# EAGLE schematic Cautin (EAGLE 9.6.2)
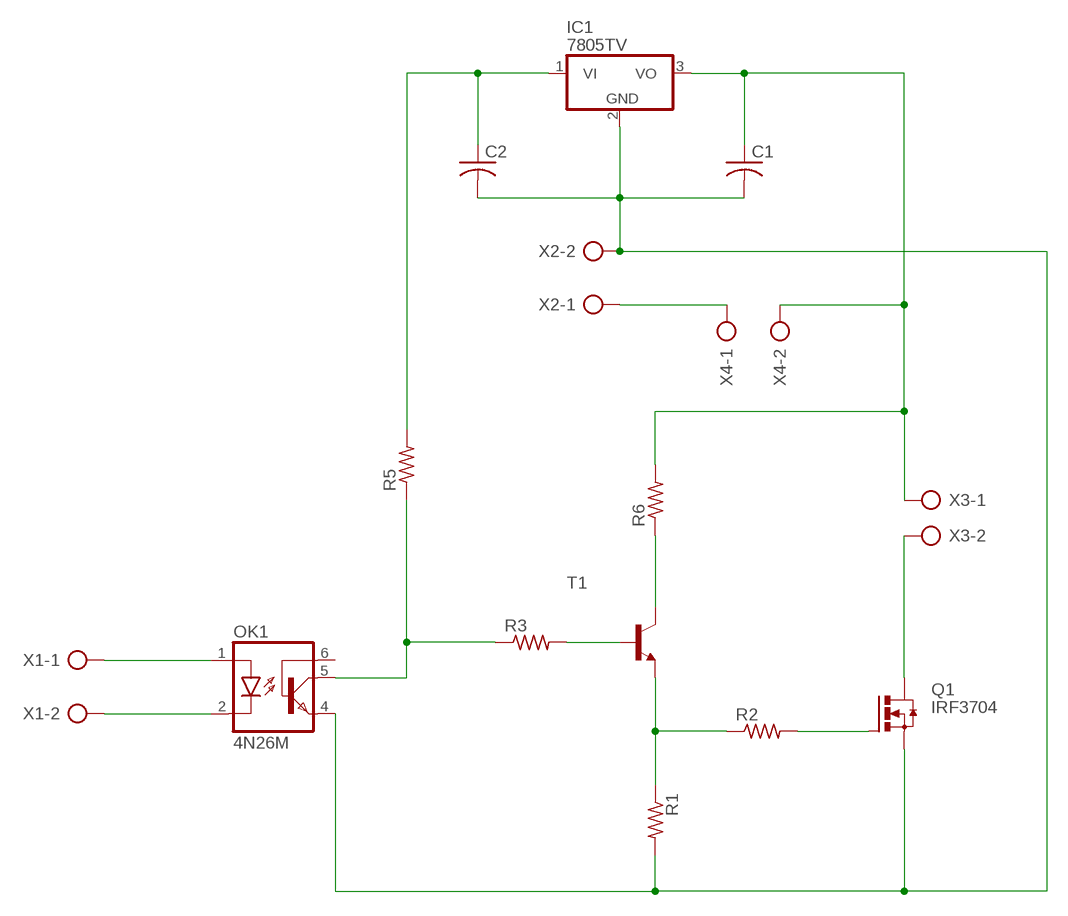
[diagram p0: schematic, sheet 1]

## Parts
C1  C-US025-024X044  [C025-024X044]
C2  C-US025-024X044  [C025-024X044]
IC1  7805TV  [TO220V]
OK1  4N26M  [DIL06]
Q1  IRF3704  [TO220AH]
R1  R-US_0207/12  [0207/12]
R2  R-US_0207/12  [0207/12]
R3  R-US_0207/12  [0207/12]
R5  R-US_0207/12  [0207/12]
R6  R-US_0207/15  [0207/15]
T1  2N2222-NPN-TO92-EBC  [TO92-EBC]
X1  AK500/2  [AK500/2]
X2  AK500/2  [AK500/2]
X3  AK500/2  [AK500/2]
X4  AK500/2  [AK500/2]

## Nets
N$1: OK1.1(A) X1.1
N$2: C1.1 IC1.3(VO) R6.2 X3.1 X4.2
N$3: C2.1 IC1.1(VI) R5.2
N$4: X2.1 X4.1
N$5: C1.2 C2.2 IC1.2(GND) OK1.4(EMI) Q1.E(S) R1.2 X2.2
N$6: OK1.5(COL) R3.1 R5.1
N$7: R3.2 T1.B
N$8: R1.1 R2.1 T1.E
N$9: Q1.B(G) R2.2
N$10: Q1.C(D) X3.2
N$12: OK1.2(C) X1.2
N$13: R6.1 T1.C
Unconnected: OK1.6(BAS)

## Library data of the parts
C1 C2 = rcl:C-US: CAPACITOR, American symbol; SPICEPREFIX: C
IC1 = linear:78*: Positive VOLTAGE REGULATOR Source: http://cache.national.com/ds/LM/LM78L05.pdf http://www.fairchildsemi.com/ds/LM/LM7805.pdf
OK1 = optocoupler:4N*?M: General Purpose 6-Pin Phototransistor Optocouplers Source: http://www.fairchildsemi.com/ds/4N/4N35-M.pdf; MPN: 4N26-M; OC_FARNELL: 1021350; OC_NEWARK: 98K9089
Q1 = transistor-power:IRF3704: SMPS MOSFET HEXFET® Power MOSFET Source: http://www.irf.com/product-info/datasheets/data/irf3704.pdf
R1-R3 R5 R6 = rcl:R-US_: RESISTOR, American symbol; SPICEPREFIX: R
T1 = transistor-neu-to92:*-NPN-: NPN Transistror
X1-X4 = con-ptr500:AK500/2: CONNECTOR; OC_FARNELL: unknown; OC_NEWARK: unknown